# EAGLE design SolderingIronDriver-V1-PTH (EAGLE 5.11)
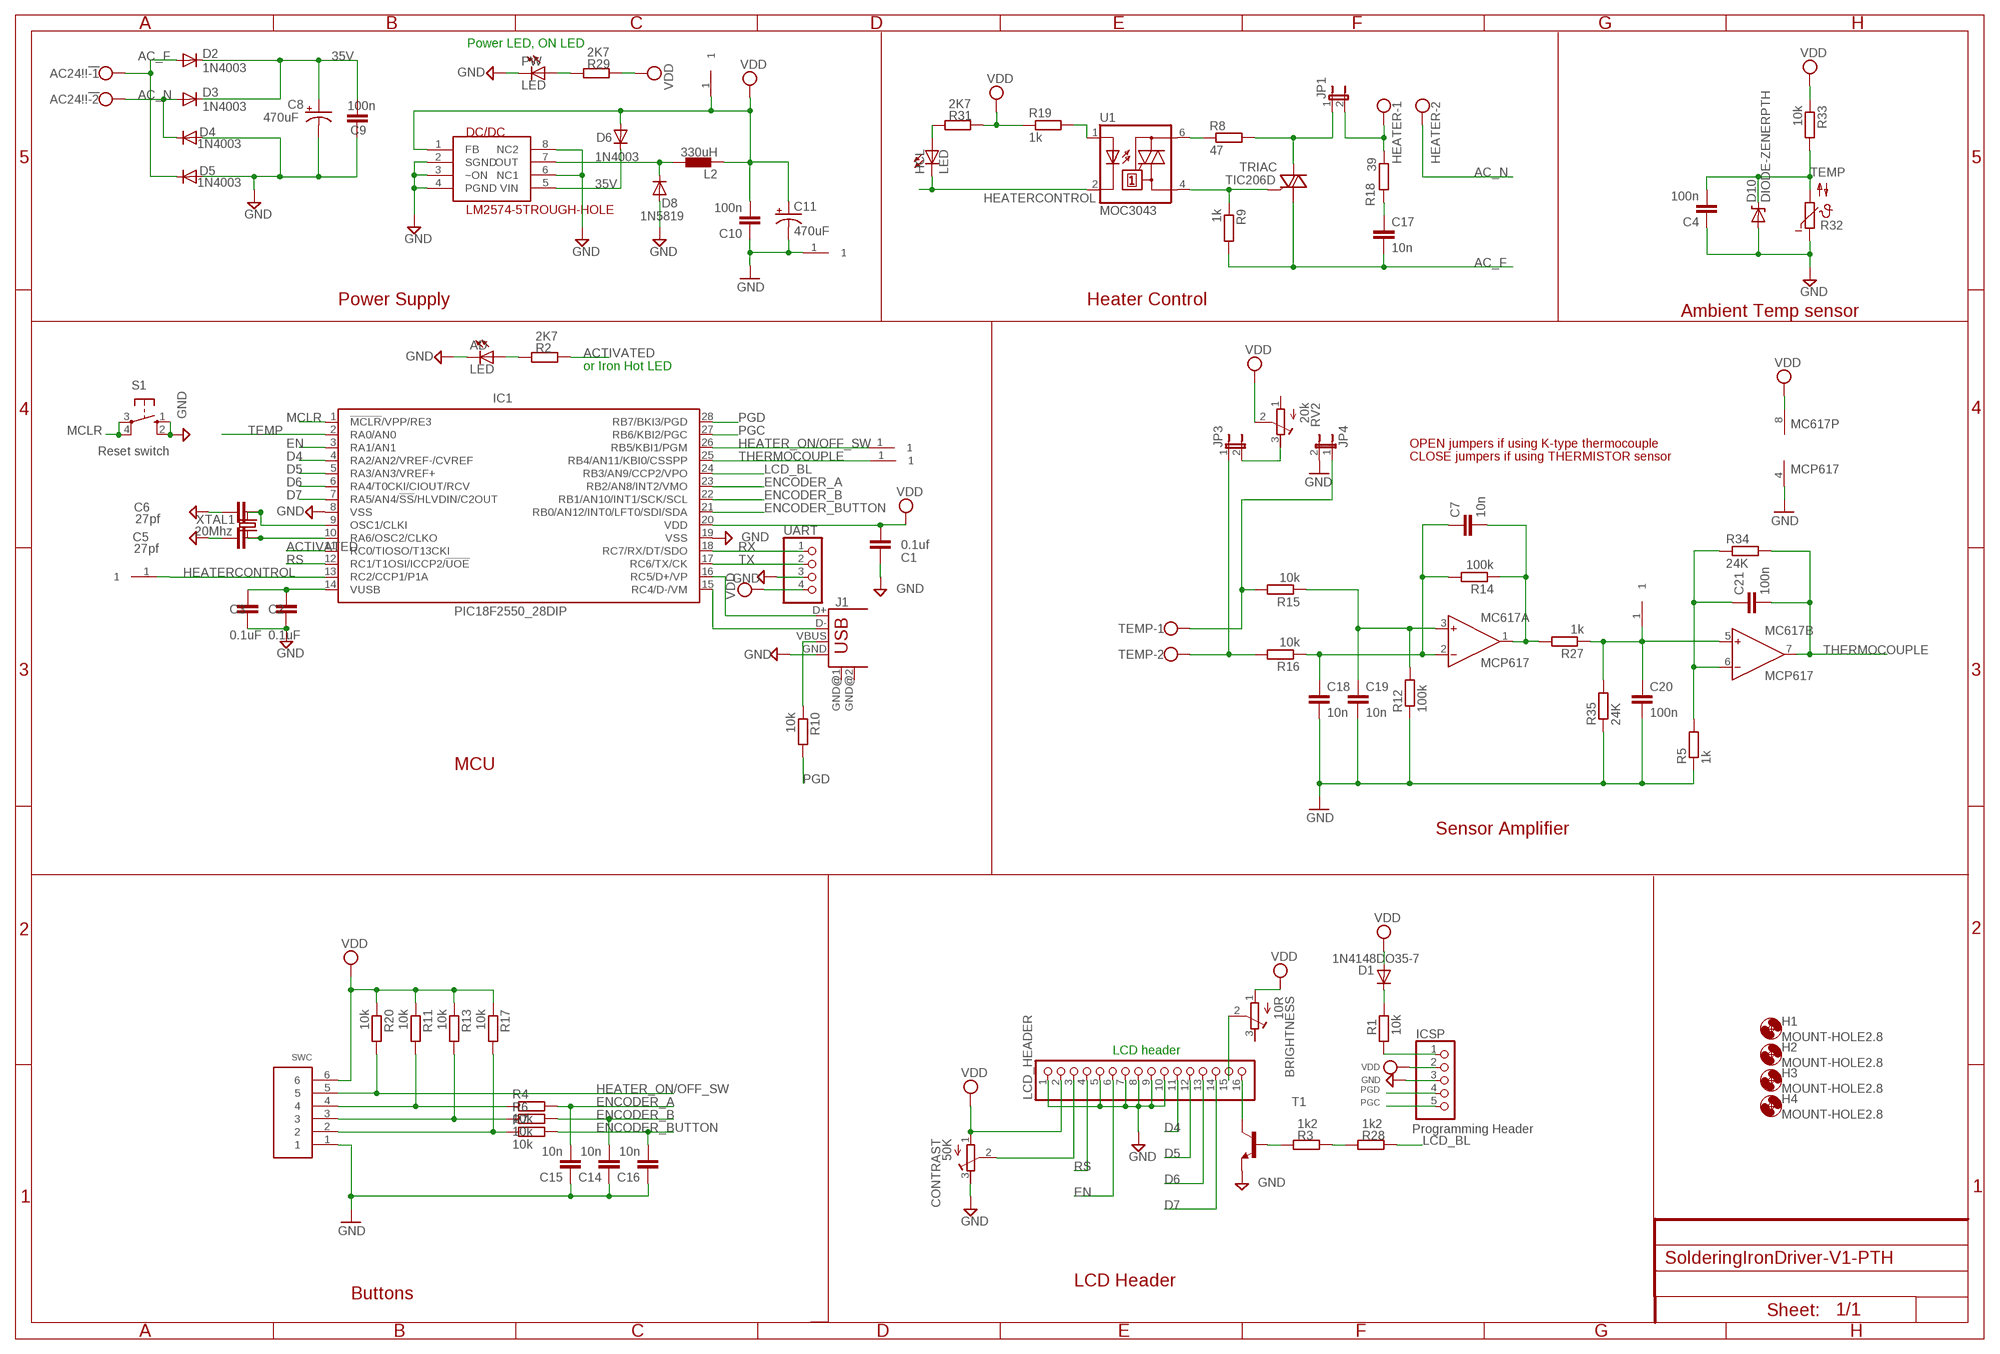
[diagram p0: schematic, sheet 1]

## Parts
5V  HEADER1X1PTH  [M1X1]
AC24!!!  W237-102  [W237-102]
AD  LED  LED3MM  [LED3MM]
AMP  HEADER1X1PTH  [M1X1]
BRIGHTNESS  10R  R-TRIMM3339P  [RTRIM3339P]
C1  0.1uf  CAPDECOUPLING  [DEC]
C2  0.1uF  CAPDECOUPLING  [DEC]
C3  0.1uF  CAPDECOUPLING  [DEC]
C4  100n  CAPDECOUPLING  [DEC]
C5  27pf  CAPDECOUPLING  [DEC]
C6  27pf  CAPDECOUPLING  [DEC]
C7  10n  CAPDECOUPLING  [DEC]
C8  470uF  CAP-ELD10-P200  [CAP-D10-P200MIL]
C9  100n  CAPDECOUPLING  [DEC]
C10  100n  CAPDECOUPLING  [DEC]
C11  470uF  CAP-ELD63MP100  [CAP-D6.3MM-P100MIL]
C14  10n  CAPDECOUPLING  [DEC]
C15  10n  CAPDECOUPLING  [DEC]
C16  10n  CAPDECOUPLING  [DEC]
C17  10n  CAPDECOUPLING  [DEC]
C18  10n  CAPDECOUPLING  [DEC]
C19  10n  CAPDECOUPLING  [DEC]
C20  100n  CAPDECOUPLING  [DEC]
C21  100n  CAPDECOUPLING  [DEC]
CONTRAST  50K  R-TRIMM3339P  [RTRIM3339P]
D1  1N4148DO35-7  [DO35-7]
D2  1N4003  DIODE-DO41-7.6  [DO41-7.6]
D3  1N4003  DIODE-DO41-7.6  [DO41-7.6]
D4  1N4003  DIODE-DO41-7.6  [DO41-7.6]
D5  1N4003  DIODE-DO41-7.6  [DO41-7.6]
D6  1N4003  DIODE-DO41-7.6  [DO41-7.6]
D8  1N5819  DIODE-DO41-7.6  [DO41-7.6]
D10  DIODE-ZENERPTH  [DIODE-ZENER]
DC/DC  LM2574-5TROUGH-HOLE  [DIL-08]
GND  HEADER1X1PTH  [M1X1]
H1  MOUNT-HOLE2.8  [2,8]
H2  MOUNT-HOLE2.8  [2,8]
H3  MOUNT-HOLE2.8  [2,8]
H4  MOUNT-HOLE2.8  [2,8]
HC  HEADER1X1PTH  [M1X1]
HCL  LED  LED3MM  [LED3MM]
HEATER  W237-102  [W237-102]
IC1  PIC18F2550_28DIP  [DIL28-3]
ICSP  PINHD-1X5  [1X05]
JP1  JP1E  [JP1]
JP3  JP1E  [JP1]
JP4  JP1E  [JP1]
L2  330uH  CL330UH  [CW8A]
LCD_HEADER  PINHD-1X16  [1X16]
MC617  MCP617  AD712N  [DIL08]
ON/OFF  HEADER1X1PTH  [M1X1]
PW  LED  LED3MM  [LED3MM]
R1  10k  R-EU_0204/7  [0204/7]
R2  2K7  RESISTORTH  [RTH025W]
R3  1k2  RESISTORDPTH  [RTH025W]
R4  10k  RESISTORTH  [RTH025W]
R5  1k  RESISTORTH  [RTH025W]
R6  10k  RESISTORTH  [RTH025W]
R7  10k  RESISTORTH  [RTH025W]
R8  47  RESISTORTH  [RTH025W]
R9  1k  RESISTORTH  [RTH025W]
R10  10k  RESISTORTH  [RTH025W]
R11  10k  RESISTORTH  [RTH025W]
R12  100k  RESISTORTH  [RTH025W]
R13  10k  RESISTORTH  [RTH025W]
R14  100k  RESISTORTH  [RTH025W]
R15  10k  RESISTORTH  [RTH025W]
R16  10k  RESISTORTH  [RTH025W]
R17  10k  RESISTORTH  [RTH025W]
R18  39  RESISTORTH  [RTH025W]
R19  1k  RESISTORTH  [RTH025W]
R20  10k  RESISTORTH  [RTH025W]
R27  1k  RESISTORTH  [RTH025W]
R28  1k2  RESISTORTH  [RTH025W]
R29  2K7  RESISTORTH  [RTH025W]
R31  2K7  RESISTORTH  [RTH025W]
R32  NTC640-9  [N640]
R33  10k  RESISTORTH  [RTH025W]
R34  24K  RESISTORTH  [RTH025W]
R35  24K  RESISTORTH  [RTH025W]
RV2  20k  R-TRIMM3339P  [RTRIM3339P]
S1  10-XX  [B3F-10XX]
SWC  HEADER1X6PTH  [M1X6]
T1  BJT-NPNTO92ECB  [TO92-ECB]
TC  HEADER1X1PTH  [M1X1]
TEMP  W237-102  [W237-102]
TRIAC  TIC206D  [TO220BV]
U1  MOC3043  MOC3043M  [DIL06]
UART  PINHD-1X4  [1X04]
USB  USB  USB-B-H  [USB-B-H]
XTAL1  20Mhz  CRYSTALHC49U70  [HC49U70]

## Nets
35V: C8.+ C9.2 D2.C D3.C D6.C DC/DC.5(VIN)
AC_F: AC24!!!.1 C17.2 D2.A D5.C R9.2 TRIAC.T1(A1)
AC_N: AC24!!!.2 D3.A D4.C HEATER.2
ACTIVATED: IC1.11(RC0/TIOSO/T13CKI) R2.2
D4: IC1.4(RA2/AN2/VREF-/CVREF) LCD_HEADER.11
D5: IC1.5(RA3/AN3/VREF+) LCD_HEADER.12
D6: IC1.6(RA4/T0CKI/CIOUT/RCV) LCD_HEADER.13
D7: IC1.7(RA5/AN4/!SS!/HLVDIN/C2OUT) LCD_HEADER.14
EN: IC1.3(RA1/AN1) LCD_HEADER.6
ENCODER_A: C15.2 IC1.23(RB2/AN8/INT2/VMO) R4.2
ENCODER_B: C14.2 IC1.22(RB1/AN10/INT1/SCK/SCL) R6.2
ENCODER_BUTTON: C16.2 IC1.21(RB0/AN12/INT0/LFT0/SDI/SDA) R7.2
GND: AD.K(C) C1.2 C2.2 C3.2 C4.1 C5.2 C6.2 C8.- C9.1 C10.1 C11.- C14.1 C15.1 C16.1 C18.2 C19.2 C20.2 CONTRAST.3(A) D4.A D5.A D8.A D10.P$2(A) DC/DC.2(SGND) DC/DC.3(~ON) DC/DC.4(PGND) DC/DC.6(NC1) DC/DC.8(NC2) GND.1 IC1.8(VSS) IC1.19(VSS) ICSP.3 JP4.2 LCD_HEADER.1 LCD_HEADER.5 LCD_HEADER.7 LCD_HEADER.8 LCD_HEADER.9 LCD_HEADER.10 MC617.4(P:V-) PW.K(C) R5.1 R12.1 R32.1 R35.1 S1.1(S) S1.2(S1) SWC.1 T1.E UART.3 USB.GND
HEATER_ON/OFF_SW: IC1.26(RB5/KBI1/PGM) ON/OFF.1 R20.2 SWC.5
HEATERCONTROL: HC.1 HCL.K(C) IC1.13(RC2/CCP1/P1A) U1.2(C)
LCD_BL: IC1.24(RB3/AN9/CCP2/VPO) R28.2
MCLR: IC1.1(!MCLR!/VPP/RE3) ICSP.1 R1.1 S1.3(P) S1.4(P1)
N$1: C6.1 IC1.9(OSC1/CLKI) XTAL1.2
N$2: C5.1 IC1.10(RA6/OSC2/CLKO) XTAL1.1
N$3: R10.1 USB.VBUS
N$4: R3.1 T1.B
N$5: R3.2 R28.1
N$6: HCL.A R31.1
N$7: AD.A R2.1
N$8: R4.1 R11.2 SWC.4
N$9: R6.1 R13.2 SWC.3
N$10: D1.C R1.2
N$11: LCD_HEADER.16 T1.C
N$12: BRIGHTNESS.2(S) LCD_HEADER.15
N$13: R7.1 R17.2 SWC.2
N$14: C2.1 C3.1 IC1.14(VUSB)
N$15: HEATER.1 JP1.2 R18.1
N$18: JP1.1 R8.2 TRIAC.T2(A2)
N$19: C17.1 R18.2
N$20: R9.1 TRIAC.G U1.4(A1)
N$21: R8.1 U1.6(A2)
N$22: R19.2 U1.1(A)
N$24: JP4.1 R15.2 TEMP.1
N$25: JP3.1 R16.2 TEMP.2
N$26: C7.1 C18.1 MC617.2(A:IN-) R14.2 R16.1
N$27: C19.1 MC617.3(A:IN+) R12.2 R15.1
N$28: C7.2 MC617.1(A:OUT) R14.1 R27.2
N$31: AMP.1 C20.1 MC617.5(B:IN+) R27.1 R35.2
N$32: C21.1 MC617.6(B:IN-) R5.2 R34.1
N$35: JP3.2 RV2.3(A)
N$38: PW.A R29.1
N$46: CONTRAST.2(S) LCD_HEADER.3
PGC: IC1.27(RB6/KBI2/PGC) ICSP.5
PGD: IC1.28(RB7/BKI3/PGD) ICSP.4 R10.2
RC4: IC1.15(RC4/D-/VM) USB.D-
RC5: IC1.16(RC5/D+/VP) USB.D+
RS: IC1.12(RC1/T1OSI/ICCP2/!UOE) LCD_HEADER.4
RX: IC1.18(RC7/RX/DT/SDO) UART.1
SW-OUT: D8.C DC/DC.7(OUT) L2.2
TEMP: C4.2 D10.P$1(C) IC1.2(RA0/AN0) R32.2 R33.2
THERMOCOUPLE: C21.2 IC1.25(RB4/AN11/KBI0/CSSPP) MC617.7(B:OUT) R34.2 TC.1
TX: IC1.17(RC6/TX/CK) UART.2
VDD: 5V.1 BRIGHTNESS.1(E) C1.1 C10.2 C11.+ CONTRAST.1(E) D1.A D6.A DC/DC.1(FB) IC1.20(VDD) ICSP.2 L2.1 LCD_HEADER.2 MC617.8(P:V+) R11.1 R13.1 R17.1 R19.1 R20.1 R29.2 R31.2 R33.1 RV2.2(S) SWC.6 UART.4
Unconnected: BRIGHTNESS.3(A) RV2.1(E) USB.GND@1(GND) USB.GND@2(GND)

## Notes on the sheet
- Power LED, ON LED
- Power Supply | Heater Control
- Ambient Temp sensor
- or Iron Hot LED
- OPEN jumpers if using K-type thermocouple
- Reset switch
- CLOSE jumpers if using THERMISTOR sensor
- J1
- MCU
- Sensor Amplifier
- LCD header
- Programming Header
- LCD Header
- Buttons

## Library data of the parts
5V AMP GND HC ON/OFF TC = dp_devices:HEADER1X1
AC24!!! HEATER TEMP = con-wago-500:W237-102: WAGO SCREW CLAMP; MPN: 237-102; OC_FARNELL: unknown; OC_NEWARK: 70K9898
AD HCL PW = led:LED: LED OSRAM: - CHIPLED LG R971, LG N971, LY N971, LG Q971, LY Q971, LO R971, LY R971 LH N974, LH R974 LS Q976, LO Q976, LY Q976 LO Q996 - Hyper CHIPLED LW Q18S LB Q993, LB Q99A, LB R99A - SideLED LS A670, LO A670, LY A670, LG A670, LP A670 LB A673, LV A673, LT A673, LW A673 LH A674 LY A675 LS A676, LA A676, LO A676, LY A676, LW A676 LS A679, LY A679, LG A679 - Hyper Micro SIDELED® LS Y876, LA Y876, LO Y876, LY Y876 LT Y87S - SmartLED LW L88C, LW L88S LB L89C, LB L89S, LG L890 LS L89K, LO L89K, LY L89K LS L896, LA L896, LO L896, LY L896 - TOPLED LS T670, LO T670, LY T670, LG T670, LP T670 LSG T670, LSP T670, LSY T670, LOP T670, LYG T670 LG T671, LOG T671, LSG T671 LB T673, LV T673, LT T673, LW T673 LH T674 LS T676, LA T676, LO T676, LY T676, LB T676, LH T676, LSB T676, LW T676 LB T67C, LV T67C, LT T67C, LS T67K, LO T67K, LY T67K, LW E67C LS E67B, LA E67B, LO E67B, LY E67B, LB E67C, LV E67C, LT E67C LW T67C LS T679, LY T679, LG T679 LS T770, LO T770, LY T770, LG T770, LP T770 LB T773, LV T773, LT T773, LW T773 LH T774 LS E675, LA E675, LY E675, LS T675 LS T776, LA T776, LO T776, LY T776, LB T776 LHGB T686 LT T68C, LB T68C - Hyper Mini TOPLED® LB M676 - Mini TOPLED Santana® LG M470 LS M47K, LO M47K, LY M47K Source: http://www.osram.convergy.de LUXEON: - LUMILED® LXK2-PW12-R00, LXK2-PW12-S00, LXK2-PW14-U00, LXK2-PW14-V00 LXK2-PM12-R00, LXK2-PM12-S00, LXK2-PM14-U00 LXK2-PE12-Q00, LXK2-PE12-R00, LXK2-PE12-S00, LXK2-PE14-T00, LXK2-PE14-U00 LXK2-PB12-K00, LXK2-PB12-L00, LXK2-PB12-M00, LXK2-PB14-N00, LXK2-PB14-P00, LXK2-PB14-Q00 LXK2-PR12-L00, LXK2-PR12-M00, LXK2-PR14-Q00, LXK2-PR14-R00 LXK2-PD12-Q00, LXK2-PD12-R00, LXK2-PD12-S00 LXK2-PH12-R00, LXK2-PH12-S00 LXK2-PL12-P00, LXK2-PL12-Q00, LXK2-PL12-R00 Source: www.luxeon.com KINGBRIGHT: KA-3528ASYC Source: www.kingbright.com
BRIGHTNESS CONTRAST RV2 = rcl:R-TRIMM: Trimm resistor
C1-C7 C9 C10 C17-C21 = dp_devices:CAP
C8 C11 = fica:CAP-EL
C14-C16 = fica:CAP
D1 = diode:1N4148: DIODE high speed (Philips)
D2-D6 D8 = diode:DIODE-: DIODE
D10 = SparkFun:DIODE-ZENER: Zener Diode Production Part - 8199 3.4V Zener Voltage
DC/DC = fica:LM2574-5
H1-H4 = holes:MOUNT-HOLE: MOUNTING HOLE with drill center marker
IC1 = microchip:PIC18F2*_28: USB Microcontrollers with nanoWatt Technology High-Performance, Enhanced Flash, 28/40/44-Pin, Source: http://ww1.microchip.com/downloads/en/devicedoc/39632c.pdf
ICSP = pinhead-2:PINHD-1X5: PIN HEADER
JP1 JP3 JP4 = jumper:JP1E: JUMPER
L2 = fica:CL330UH
LCD_HEADER = fica:PINHD-1X16: PIN HEADER
MC617 = analog-devices:AD712: Dual Precision, Low Cost, High Speed BiFET Op Amp Source: http://www.analog.com/static/imported-files/data_sheets/AD712.pdf; MF: ALTERA CORPORATION; MPN: AD712JNZ; OC_FARNELL: 9604898; OC_NEWARK: 59K4554
R1 = rcl:R-EU_: RESISTOR, European symbol
R2 R4-R20 R27-R29 R31 R33-R35 = dp_devices:RESISTOR
R3 = fica:RESISTORDP
R32 = ptc-ntc:NTC640-9: PHILIPS NTC; OC_FARNELL: unknown; OC_NEWARK: unknown
S1 = switch-omron:10-XX: OMRON SWITCH
SWC = dp_devices:HEADER1X6
T1 = dp_devices:BJT-NPN: Most commonly used is SOT23-BEC
TRIAC = triac:TIC206: TRIAC Source: http://www.bourns.com/pdfs/tic206.pdf
U1 = optocoupler:MOC30*: 6-Pin DIP Zero-Cross Optoisolators Triac Driver Output (250/400 Volt Peak) Source: http://www.fairchildsemi.com/ds/MO/MOC3043-M.pdf; MF: FAIRCHILD SEMICONDUCTOR; MPN: MOC3043-M; OC_FARNELL: 1021371; OC_NEWARK: 72K8900
UART = pinhead:PINHD-1X4: PIN HEADER
USB = con-usb-2:USB: USB Connectors
XTAL1 = crystal:CRYSTAL: CRYSTAL

## Board
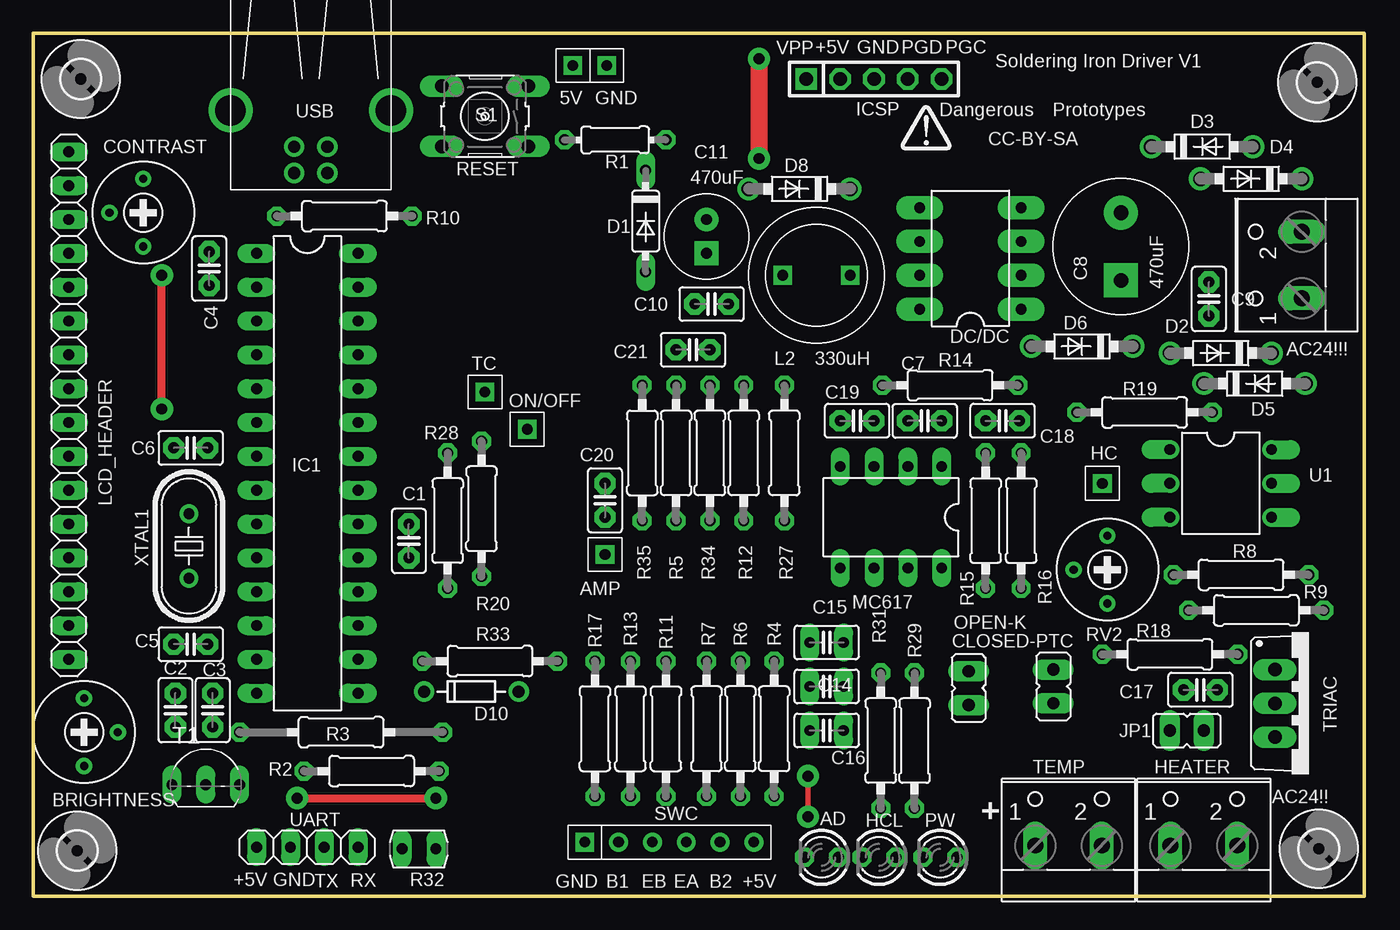
[diagram p1: board, top side]
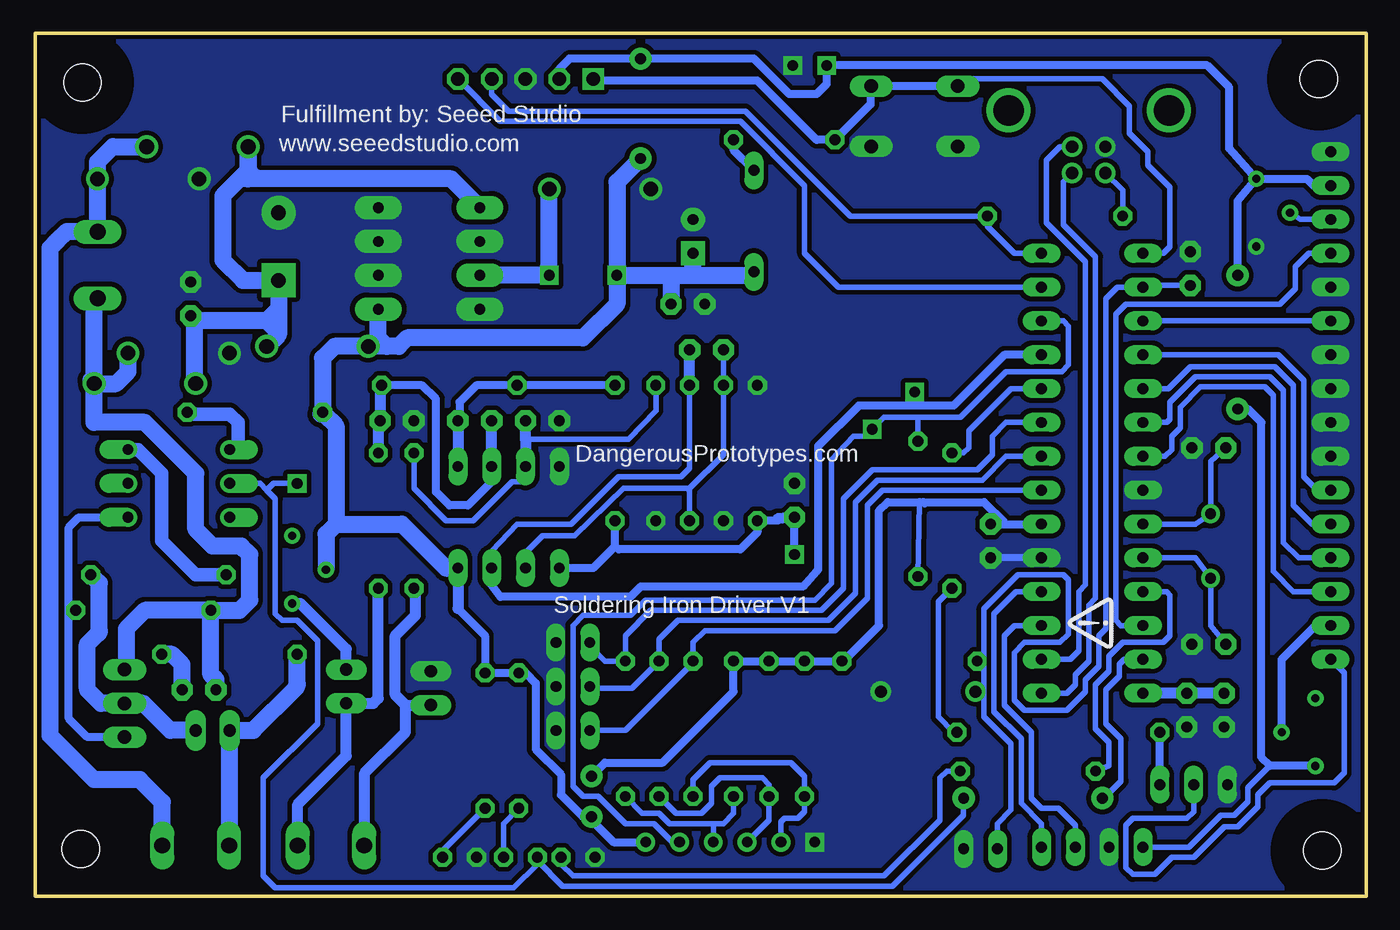
[diagram p2: board, bottom side, seen from below]

Size 99.95 x 64.77 mm. Coordinates in mm from the lower left corner, seen from the top.
Outline: 0,0 0,64.77 99.95,64.77 99.95,0 0,0
Copper layers (1*16): Top 0.035mm / dielectric 1.5mm / Bottom 0.035mm
Design rules "SparkFun *": minimum track width 16mil, minimum drill 20mil, track to track 14mil, track to pad 14mil, pad to pad 14mil, via to via 14mil, smd to smd 8mil, copper to edge 10mil, drill to drill 8mil, minimum pad ring 12mil, minimum via ring 10mil, stop-mask expansion 4mil, vias tented up to drill 25mil, thermal gap 10mil

### Footprints (pad centres in the part's own frame; a part is rotated, then mirrored left to right if it is on the bottom)
M1X1 = drill 0.8 square: 1 0,0
W237-102 = drill 1.194 long: 1 -2.5,-1.27; 2 2.5,-1.27
LED3MM = drill 0.813 octagon: A -1.27,0; K 1.27,0
RTRIM3339P = drill 0.61 round: 1 -2.54,0; 2 0,-2.54; 3 2.54,0
DEC = drill 0.813 pad 1.6 octagon: 1 -1.27,0; 2 1.27,0
CAP-D10-P200MIL = drill 1.1 pad 2.54 square: + -2.54,0 | drill 1.1 pad 2.54 round: - 2.54,0
CAP-D6.3MM-P100MIL = drill 0.8 pad 1.778 square: + -1.27,0 | drill 0.8 pad 1.778 round: - 1.27,0
DEC' = drill 0.813 pad 1.422 long: 1 -1.27,0; 2 1.27,0
DO35-7 = drill 0.813 long: A 3.81,0; C -3.81,0
DO41-7.6 = drill 1.1 pad 1.7 round: A 3.81,0; C -3.81,0
DIODE-ZENER = drill 0.9 round: P$1 -3.556,0; P$2 3.556,0
DIL-08 = drill 0.813 pad 1.778 long: 1 -3.81,-3.81; 2 -1.27,-3.81; 3 1.27,-3.81; 4 3.81,-3.81; 5 3.81,3.81; 6 1.27,3.81; 7 -1.27,3.81; 8 -3.81,3.81
2,8 = hole 2.8: 0,0
DIL28-3 = drill 0.813 long: 1 -16.51,-3.81; 2 -13.97,-3.81; 3 -11.43,-3.81; 4 -8.89,-3.81; 5 -6.35,-3.81; 6 -3.81,-3.81; 7 -1.27,-3.81; 8 1.27,-3.81; 9 3.81,-3.81; 10 6.35,-3.81; 11 8.89,-3.81; 12 11.43,-3.81; 13 13.97,-3.81; 14 16.51,-3.81; 15 16.51,3.81; 16 13.97,3.81; 17 11.43,3.81; 18 8.89,3.81; 19 6.35,3.81; 20 3.81,3.81; 21 1.27,3.81; 22 -1.27,3.81; 23 -3.81,3.81; 24 -6.35,3.81; 25 -8.89,3.81; 26 -11.43,3.81; 27 -13.97,3.81; 28 -16.51,3.81
1X05 = drill 1.016 square: 1 -5.08,0 | drill 1.016 octagon: 2 -2.54,0; 3 0,0; 4 2.54,0; 5 5.08,0
JP1 = drill 0.914 long: 1 0,-1.27; 2 0,1.27
CW8A = drill 0.8 square: 1 -2.54,0; 2 2.54,0
1X16 = drill 0.813 long: 1 -19.05,0; 2 -16.51,0; 3 -13.97,0; 4 -11.43,0; 5 -8.89,0; 6 -6.35,0; 7 -3.81,0; 8 -1.27,0; 9 1.27,0; 10 3.81,0; 11 6.35,0; 12 8.89,0; 13 11.43,0; 14 13.97,0; 15 16.51,0; 16 19.05,0
DIL08 = drill 0.813 long: 1 -3.81,-3.81; 2 -1.27,-3.81; 3 1.27,-3.81; 4 3.81,-3.81; 5 3.81,3.81; 6 1.27,3.81; 7 -1.27,3.81; 8 -3.81,3.81
0204/7 = drill 0.813 octagon: 1 -3.81,0; 2 3.81,0
RTH025W = drill 0.813 octagon: 1 -5.08,0; 2 5.08,0
RTH025W' = drill 0.813 octagon: 1 -7.62,0; 2 7.62,0
N640 = drill 0.813 long: 1 -1.27,0; 2 1.27,0
B3F-10XX = drill 1.016 long: 1 -3.251,2.261; 2 3.251,2.261; 3 -3.251,-2.261; 4 3.251,-2.261
M1X6 = drill 0.8 square: 1 0,0 | drill 0.8 round: 2 2.54,0; 3 5.08,0; 4 7.62,0; 5 10.16,0; 6 12.7,0
TO92-ECB = drill 0.813 long: B 2.54,0; C 0,0; E -2.54,0
TO220BV = drill 1.016 long: G 2.54,-2.54; T1 -2.54,-2.54; T2 0,-2.54
DIL06 = drill 0.813 offset: 1 -2.54,-3.81; 2 0,-3.81; 3 2.54,-3.81; 4 2.54,3.81; 5 0,3.81; 6 -2.54,3.81
1X04 = drill 0.813 long: 1 -3.81,0; 2 -1.27,0; 3 1.27,0; 4 3.81,0
USB-B-H = drill 0.914 round: D+ 0,1.25; D- 1.981,1.25; GND 0,-1.25; VBUS 1.981,-1.25 | drill 2.286 round: GND@1 -2.718,6.02; GND@2 -2.718,-6.02
HC49U70 = drill 0.813 round: 1 -2.413,0; 2 2.413,0

### Placement (x,y rotation side)
5V  40.51,62.36 0 top
AC24!!!  93.98,47.37 90 top
AD  59.18,2.92 180 top
AMP  42.93,25.65 0 top
BRIGHTNESS  3.81,12.32 90 top
C1  28.19,26.67 270 top
C2  10.67,13.97 270 top
C3  13.46,13.97 270 top
C4  13.21,47.12 270 top
C5  11.81,18.92 0 top
C6  11.81,33.66 0 top
C7  66.93,35.69 0 top
C8  81.66,48.77 90 top
C9  88.27,44.83 270 top
C10  50.93,44.45 0 top
C11  50.55,49.53 90 top
C14  10n  [DEC']  59.56,15.75 180 top
C15  10n  [DEC']  59.56,19.05 180 top
C16  10n  [DEC']  59.56,12.45 180 top
C17  87.63,15.49 180 top
C18  72.77,35.69 180 top
C19  61.85,35.69 180 top
C20  42.93,29.72 90 top
C21  49.53,41.02 0 top
CONTRAST  8.26,51.31 270 top
D1  45.97,50.67 270 top
D2  91.69,38.48 0 top
D3  87.76,56.26 0 top
D4  91.44,53.85 180 top
D5  89.15,40.77 180 top
D6  78.74,41.27 180 top
D8  57.53,53.09 180 top
D10  32.89,15.37 0 top
DC/DC  70.36,47.88 90 top
GND  43.05,62.36 0 top
H1  3.3,3.43 0 top
H2  3.56,61.34 0 top
H3  96.39,61.09 0 top
H4  96.52,3.56 0 top
HC  80.26,30.99 0 top
HCL  63.5,2.92 180 top
HEATER  87.88,5.08 0 top
IC1  20.57,31.75 270 top
ICSP  63.12,61.34 0 top
JP1  86.61,12.45 90 top
JP3  76.58,15.75 0 top
JP4  70.23,15.62 0 top
L2  58.8,46.61 0 top
LCD_HEADER  2.67,36.83 270 top
MC617  64.39,28.45 180 top
ON/OFF  37.08,35.05 0 top
PW  68.07,2.92 180 top
R1  43.69,56.77 0 top
R2  25.4,9.4 180 top
R3  1k2  [RTH025W']  23.11,12.32 0 top
R4  55.63,12.57 90 top
R5  48.26,33.27 90 top
R6  53.09,12.57 90 top
R7  50.55,12.57 90 top
R8  90.68,24.13 0 top
R9  91.82,21.46 180 top
R10  23.37,51.05 0 top
R11  47.5,12.57 270 top
R12  53.34,33.27 90 top
R13  44.83,12.57 270 top
R14  68.83,38.35 0 top
R15  71.5,28.19 270 top
R16  74.17,28.19 270 top
R17  42.16,12.57 270 top
R18  85.34,18.16 0 top
R19  83.44,36.32 0 top
R20  33.66,29.08 90 top
R27  56.39,33.27 90 top
R28  31.11,28.19 90 top
R29  66.17,11.68 90 top
R31  63.63,11.68 90 top
R32  28.96,3.56 180 top
R33  34.29,17.65 180 top
R34  50.8,33.27 90 top
R35  45.72,33.27 270 top
RV2  80.64,24.51 270 top
S1  33.91,58.55 180 top
SWC  41.4,4.06 0 top
T1  12.95,8.38 0 top
TC  33.91,37.85 0 top
TEMP  77.72,5.08 0 top
TRIAC  95.76,14.48 270 top
U1  89.15,30.99 270 top
U$1  [DP-LOGO]  65.13,55.98 0 top
U$2  [DP-LOGO]  19,18.59 90 bottom
UART  20.57,3.68 180 top
USB  20.83,56.26 270 top
XTAL1  11.68,26.29 90 top

### Tracks (layer width: path | path; a pad name or v marks a point on that pad's centre or on a via)
35V
  Bottom 1.27: 88.01,43.18 C9.2 | DC/DC.5 68.71,53.85 83.95,53.85 | 88.01,43.18 88.01,38.61 D2.C | 83.95,53.85 84.58,53.85 | 84.58,53.85 85.85,52.58 85.85,47.75 84.33,46.23 C8.+ 81.66,42.29 | 81.66,42.29 81.66,42.16 D6.C | 81.66,42.29 82.55,43.18 | 82.55,43.18 88.01,43.18 | 82.55,43.18 81.79,43.94 | 83.95,53.85 D3.C 83.95,54.48 | 84.58,53.85 83.95,54.48 | 83.95,54.48 83.44,53.98
AC_F
  Bottom 1.27: D2.A 95.5,35.56 91.69,35.56 87.88,31.75 87.88,27.56 86.61,26.29 84.45,26.29 83.82,25.65 83.82,22.23 84.58,21.46 R9.2 | D5.C 92.96,39.37 93.85,38.48 D2.A | D2.A 95.76,38.73 | AC24!!!.1 95.5,44.62 D2.A | C17.2 86.36,16.26 86.74,16.64 R9.2 | R9.2 91.69,21.46 93.09,20.07 93.09,17.14 TRIAC.T1
AC_N
  Bottom 1.27: HEATER.2 90.38,7.07 92.08,8.76 95.5,8.76 98.81,12.06 98.81,48.64 98.68,48.77 98.3,49.15 97.54,49.91 95.42,49.91 AC24!!!.2 D4.C 95.25,55.12 94.11,56.26 D3.A
ACTIVATED
  Bottom 0.406: R2.2 19.3,9.78 19.3,11.56 20.32,12.57 20.32,15.88 19.3,16.89 19.3,18.03 18.29,19.05 15.24,19.05 14.73,19.56 14.73,22.61 14.99,22.86 IC1.11
D4
  Bottom 0.406: 2.03,30.61 LCD_HEADER.11 3.68,30.48 4.7,31.5 4.7,38.73 6.6,40.64 IC1.4
D5
  Bottom 0.406: LCD_HEADER.12 4.06,27.94 5.46,29.34 5.46,38.35 6.86,39.75 13.21,39.75 14.86,38.1 IC1.5
D6
  Bottom 0.406: LCD_HEADER.13 5.08,25.4 6.22,26.54 6.22,37.97 7.24,38.99 12.83,38.99 14.73,37.08 14.73,35.81 14.99,35.56 IC1.6
D7
  Bottom 0.406: LCD_HEADER.14 5.46,22.86 6.99,24.38 6.99,37.59 7.62,38.23 12.45,38.23 13.97,36.7 13.97,35.18 14.61,34.54 14.61,33.53 15.11,33.02 IC1.7
EN
  Bottom 0.406: 3.3,43.18 LCD_HEADER.6 IC1.3
ENCODER_A
  Bottom 0.406: 24.51,35.43 IC1.23 27.05,35.56 28.07,34.54 28.07,33.15 29.21,32 37.08,32 39.24,29.84 39.24,23.11 40.89,21.46 53.72,21.46 55.63,19.56 R4.2 57.15,17.65 58.29,18.8 C15.2
ENCODER_B
  Bottom 0.406: C14.2 58.17,15.62 55.12,15.62 R6.2 53.09,19.3 51.69,20.7 40.39,20.7 38.35,22.73 38.35,29.59 36.7,31.24 28.83,31.24 27.05,33.02 IC1.22
ENCODER_BUTTON
  Bottom 0.406: IC1.21 36.32,30.48 37.47,29.34 37.47,22.35 39.88,19.94 49.66,19.94 50.55,19.05 R7.2 50.55,17.53 55.63,12.45 C16.2
GND
  Bottom 0.508: IC1.19 C1.2 27.69,25.4
  pour Bottom (isolate 0.305, no thermals): 0,64.77 0,0 100.58,0 100.58,64.64
HEATER_ON/OFF_SW
  Bottom 0.406: 33.66,35.94 36.2,35.94 ON/OFF.1 37.08,34.54 38.48,34.54 40.13,32.77 40.13,23.5 41.4,22.23 54.1,22.23 55.24,21.08 58.8,21.08 59.56,20.32 59.56,8.26 58.8,7.49 57.66,7.49 55.63,5.46 53.47,5.46 52.07,4.06 SWC.5 | 33.66,35.94 30.48,35.94 27.05,39.37 22.86,39.37 22.35,39.88 22.35,42.8 22.73,43.18 IC1.26 | 33.66,35.94 R20.2
HEATERCONTROL  (via drill 0.81 pad 1.68)
  Top 0.61: v19.81,7.37 v30.23,7.37
  Bottom 0.406: IC1.13 18.16,17.78 18.54,17.4 18.54,16.51 19.56,15.49 19.56,12.95 18.41,11.81 18.41,8.64 19.68,7.37 v19.81,7.37 | 82.55,30.48 83.06,30.99 U1.2 | 82.55,30.48 82.04,30.99 HC.1 | v30.23,7.37 30.23,6.1 35.56,0.76 60.33,0.76 62.23,2.67 HCL.K 62.23,2.41 64.01,0.64 81.92,0.64 82.8,1.52 82.8,8.89 78.74,12.95 78.74,19.18 80.26,20.7 81.41,20.7 81.92,21.21 81.92,29.84 82.55,30.48
LCD_BL
  Bottom 0.406: IC1.24 26.67,38.1 29.84,34.92 29.84,33.66 30.23,33.27 R28.2
MCLR
  Bottom 0.406: IC1.1 15.24,48.26 14.73,48.77 14.73,53.21 16.38,54.86 16.38,55.88 17.78,57.28 17.78,59.31 19.81,61.34 30.12,61.34 S1.4
  Bottom 0.61: R1.1 41.27,56.77 45.72,61.21 57.91,61.21 ICSP.1 | R1.1 39.88,57.02 | S1.4 S1.3 37.21,60.76 37.21,59.44 R1.1
N$1
  Bottom 0.406: IC1.9 12.83,27.94 XTAL1.2 11.68,32.64 C6.1
N$2
  Bottom 0.406: IC1.10 12.83,25.4 XTAL1.1 11.68,20.32 C5.1
N$3
  Bottom 0.406: R10.1 18.29,52.99 USB.VBUS
N$4
  Bottom 0.61: T1.B R3.1
N$5
  Bottom 0.406: R3.2 30.99,12.32 32.13,13.46 32.13,22.1 R28.1
N$6
  Bottom 0.406: R31.1 64.77,5.46 HCL.A
N$7
  Bottom 0.406: R2.1 31.5,9.4 32,8.89 32,5.71 36.2,1.52 59.56,1.52 60.45,2.41 AD.A
N$8
  Bottom 0.406: R11.2 47.5,6.22 48.26,5.46 49.02,5.46 | 49.02,5.46 52.32,5.46 53.09,6.22 54.36,6.22 R4.1 | 49.02,5.46 SWC.4
N$9
  Bottom 0.406: R6.1 51.82,6.22 49.91,6.22 49.15,6.99 49.15,8.26 48.51,8.89 45.34,8.89 44.83,8.38 R13.2 44.83,5.71 SWC.3
N$10
  Bottom 0.61: R1.2 47.5,56.01 D1.C
N$11
  Bottom 0.406: LCD_HEADER.16 1.65,16.76 1.65,9.27 2.41,8.51 7.24,8.51 8.13,7.62 8.13,6.73 9.65,5.21 10.67,5.21 12.95,2.92 14.61,2.92 15.88,1.65 17.53,1.65 18.03,2.16 18.03,5.33 17.53,5.84 13.46,5.84 12.95,6.35 T1.C
N$12
  Bottom 0.61: LCD_HEADER.15 3.81,20.32 6.35,17.78 BRIGHTNESS.2
N$13
  Bottom 0.406: R7.1 50.55,8.76 49.28,10.03 43.18,10.03 42.16,9.02 R17.2 42.16,6.35 42.67,5.84 43.69,5.84 43.94,5.59 SWC.2
N$14
  Bottom 0.813: IC1.14 C3.1 C2.1
N$15
  Bottom 1.27: HEATER.1 85.34,3.85 JP1.2 83.57,12.45 80.39,15.62 arc-45 80.26,15.93 R18.1
N$18
  Bottom 1.27: JP1.1 89.79,12.45 91.82,14.48 TRIAC.T2 95,14.48 95.94,15.42 arc45 96.01,15.6 96.01,18.92 95.2,19.74 arc-45 95.12,19.92 95.12,23.5 R8.2
N$19
  Bottom 1.27: 88.9,15.37 C17.1 88.9,17.4 89.66,18.16 R18.2
N$20
  Bottom 0.61: U1.4 96.65,28.45 97.41,27.69 97.41,21.46 | TRIAC.G 96.01,11.94 97.41,13.34 97.41,21.46 | 97.41,21.46 R9.1
N$21
  Bottom 1.016: R8.1 87.88,24.13 90.42,26.67 90.42,31.75 92.2,33.53 U1.6
N$22
  Bottom 1.016: R19.2 88.39,36.2 85.34,36.2 84.71,35.56 84.71,33.78 84.96,33.53 U1.1
N$24
  Bottom 0.813: 75.18,3.81 TEMP.1 75.18,3.85 75.18,9.27 72.14,12.32 72.14,14.35 | R15.2 71.37,22.99 71.37,21.08 72.9,19.56 72.9,15.11 72.14,14.35 | 72.14,14.35 JP4.1
N$25
  Bottom 0.813: R16.2 74.17,14.86 74.55,14.48 JP3.1 76.58,10.54 80.22,6.9 TEMP.2
N$26
  Bottom 0.61: MC617.2 65.66,31.11 67.44,29.34 68.83,29.34 69.85,30.35 69.85,37.34 70.87,38.35 R14.2
  Bottom 0.813: C7.1 MC617.2 65.66,31.62 | R16.1 74.17,35.56 C18.1 74.04,38.23 R14.2
N$27
  Bottom 0.406: 63.12,31.11 64.14,31.11 67.06,28.19 69.09,28.19 71.5,30.61 R15.1 | R12.2 53.34,36.45 55.37,34.29 63.12,34.29
  Bottom 0.61: 62.87,31.24 63.12,31.24 63.12,31.11
  Bottom 0.813: 63.12,31.24 MC617.3 63.12,34.29 C19.1
N$28
  Bottom 0.61: R27.2 R14.1 66.8,38.35 68.07,37.08 68.07,35.69
  Bottom 0.813: MC617.1 C7.2 68.07,35.69
N$31
  Bottom 0.61: 56.39,27.56 R27.1 56.39,26.29 | 44.2,28.32 44.32,28.19 R35.2 45.72,27.3 46.99,26.04 56.13,26.04 56.39,26.29 | MC617.5 58.04,24.64 56.39,26.29 | AMP.1 C20.1
  Bottom 0.813: MC617.5 60.58,23.62 60.33,23.88 | C20.1 44.2,28.32
N$32
  Bottom 0.406: C21.1 R5.2 48.26,33.15 50.8,30.61 R34.1 50.8,30.35 50.93,30.61 55.75,30.61 59.44,27.05 61.85,27.05 63.12,25.78 MC617.6
N$35
  Bottom 0.813: RV2.3 80.01,21.97 76.58,18.54 JP3.2
N$38
  Bottom 0.406: R29.1 69.34,3.43 PW.A
N$46
  Bottom 0.406: CONTRAST.2 4.95,50.8 LCD_HEADER.3
PGC
  Bottom 0.406: ICSP.5 65.02,58.17 46.99,58.17 42.16,53.34 42.16,48.26 39.62,45.72 IC1.27
PGD
  Bottom 0.406: ICSP.4 65.66,60.2 64.39,58.93 46.61,58.93 38.73,51.05 R10.2 28.45,50.29 26.42,48.26 IC1.28
RC4
  Bottom 0.406: USB.D- 22.73,53.62 22.73,50.42 20.32,48.01 20.32,22.35 20.83,21.84 20.83,17.65 21.84,16.64 21.84,15.88 22.48,15.24 IC1.15
RC5
  Bottom 0.406: IC1.16 22.23,17.78 21.59,18.41 21.59,22.86 21.08,23.37 21.08,47.62 24,50.55 24,55.24 22.99,56.26 USB.D+
RS
  Bottom 0.406: IC1.12 18.41,20.32 18.8,20.7 18.8,43.69 18.03,44.45 6.48,44.45 5.33,45.59 5.33,47.24 4.32,48.26 LCD_HEADER.4
RX
  Bottom 0.406: IC1.18 26.29,22.86 27.94,21.21 27.94,13.84 25.91,11.81 25.91,6.99 24.38,5.46 UART.1
SW-OUT
  Bottom 1.27: DC/DC.7 L2.2 D8.C
TEMP
  Bottom 0.406: 28.7,15.24 28.7,13.46 26.67,11.43 26.67,6.48 27.69,5.46 R32.2 | 28.7,15.24 28.7,17.78 | 28.7,17.78 28.7,21.59 26.16,24.13 22.73,24.13 22.35,23.75 22.35,19.68 22.99,19.05 25.65,19.05 26.42,18.29 26.42,14.73 25.65,13.97 22.48,13.97 21.08,15.37 21.08,16.26 20.07,17.27 20.07,19.56 19.56,20.07 19.56,44.83 18.67,45.72 IC1.2 16.64,45.85 C4.2 | R33.2 28.83,17.65 28.7,17.78 | D10.P$1 28.83,15.37 28.7,15.24
THERMOCOUPLE
  Bottom 0.406: R34.2 50.8,32.13 51.44,31.5 56.13,31.5 59.69,27.94 63.75,27.94 65.66,25.91 MC617.7
  Bottom 0.61: MC617.7 65.79,24.51 65.79,23.5 65.02,22.48 55.24,22.48 54.48,23.24 42.29,23.24 41.27,24.38 41.15,24.51 41.15,33.78 38.1,36.83 34.04,36.83 | 34.04,36.83 30.99,36.83 27.18,40.64 IC1.25 | TC.1 33.91,36.96 34.04,36.83
  Bottom 0.813: MC617.7 65.53,24.77 | 24.38,40.51 IC1.25 | R34.2 C21.2
TX
  Bottom 0.406: IC1.17 26.42,20.32 27.18,19.56 27.18,14.35 25.15,12.32 25.15,7.37 24.38,6.6 23.11,6.6 21.84,5.33 UART.2
VDD  (via drill 0.81 pad 1.68)
  Top 0.406: v58.17,5.97 v58.17,9.02
  Top 0.61: v9.65,36.58 v9.65,46.61
  Top 1.27: v54.48,62.87 v54.48,55.37
  Bottom 0.406: 2.03,53.21 2.16,53.21 2.16,53.09 | v58.17,5.97 58.17,6.6 | v58.17,9.02 58.04,9.02 | 33.53,29.59 R20.1 | UART.4 13.34,3.68 10.92,6.1 9.91,6.1 8.89,7.11 8.89,8.13 7.24,9.78
  Bottom 0.508: C1.1 26.92,27.94
  Bottom 0.61: R17.1 R13.1 R11.1 47.5,15.37 52.83,10.03 57.15,10.03 v58.17,9.02 | IC1.20 C1.1 27.18,28.07 28.7,29.59 33.27,29.59 | 2.03,53.21 LCD_HEADER.2 3.94,53.34 4.45,53.85 CONTRAST.1 | ICSP.2 60.58,62.1 59.82,62.87 v54.48,62.87 45.97,62.87 43.31,60.2 41.27,60.2 40.51,60.96 5V.1 11.94,62.36 10.29,60.71 10.29,56.13 CONTRAST.1 | 33.27,29.59 33.53,29.59 35.94,29.59 36.58,28.96 36.58,20.32 39.24,17.65 R33.1 R17.1 | R17.1 42.04,17.78 | 33.27,29.59 33.15,29.46 | R17.1 42.16,17.78 | v9.65,36.58 8.89,36.58 7.87,35.56 7.87,10.41 7.24,9.78 BRIGHTNESS.1 | CONTRAST.1 9.65,52.2 v9.65,46.61 | SWC.6 56.52,4.06 58.17,5.71 v58.17,5.97 58.8,5.97 60.45,7.62 60.45,9.14 62.36,11.05 62.36,16 63.12,16.76 R31.2 R29.2 66.17,19.56 68.2,21.59
  Bottom 0.813: R19.1 78.49,36.2 | 68.33,24.51 MC617.8 68.2,21.59
  Bottom 1.27: L2.1 52.32,46.61 | 52.32,46.61 50.55,46.61 | 50.55,46.61 C11.+ | L2.1 56.26,44.45 58.8,41.91 72.01,41.91 72.64,41.27 73.53,41.27 | R19.1 78.36,40.39 77.47,41.27 D6.A 74.8,41.27 | 78.49,36.2 78.23,36.2 77.34,35.31 77.34,27.94 | C10.2 52.2,46.48 52.32,46.61 | 50.55,46.61 46.1,46.61 45.97,46.74 D1.A | MC617.8 69.09,24.64 72.39,27.94 77.34,27.94 | 77.34,27.94 78.11,27.18 RV2.2 | L2.1 56.26,53.59 v54.48,55.37 | 73.53,41.27 74.8,41.27 | 73.53,41.27 74.17,41.91 | 74.17,41.91 DC/DC.1 | 74.8,41.27 74.17,41.91

### Text on the board
tNames: VPP | +5V | GND | PGD | PGC | Soldering Iron Driver V1 | Dangerous | Prototypes | CC-BY-SA | RESET | OPEN-K | CLOSED-PTC | AC24!! | + | +5V | GND | TX | RX | GND | B1 | EB | EA | B2 | +5V
bNames: Fulfillment by: Seeed Studio | www.seeedstudio.com | DangerousPrototypes.com | Soldering Iron Driver V1
Reference: Programming Header | Serial Port | Expansion | MCLR | +5V | GND | DATA | CLOCK | RX | TX | GND | +5V | RB5 | RB3 | GND | RB0 | RA1 | RA2 | RA3 | RA4 | RA5 | USB INFRARED TOY | CC-BY-SA | Ian Lesnet 2010 | LED | http://dangerousprototypes.com